# Altium schematic sheet HW_Mechanical_Parts.SchDoc: HW_Mechanical_Parts
size A4; Date: Not used; ApprovedBy: Not used; CheckedBy: Not used; Author: Not used; CompanyName: STMicroelectronics; DrawnBy: Not used; Engineer: Not used; Organization: Not used; Address1: Not used; Address2: Not used; Address3: Not used; Address4: Not used; DocumentNumber: Not used; Revision: Not used; SheetNumber: 22; SheetTotal: 22; CurrentTime: Not used; CurrentDate: Not used; Time: Not used; DocumentFullPathAndName: Not used; DocumentName: Not used; ModifiedDate: Not used; ImagePath: Not used; ProjectName: Not used; Application_BuildNumber: Not used
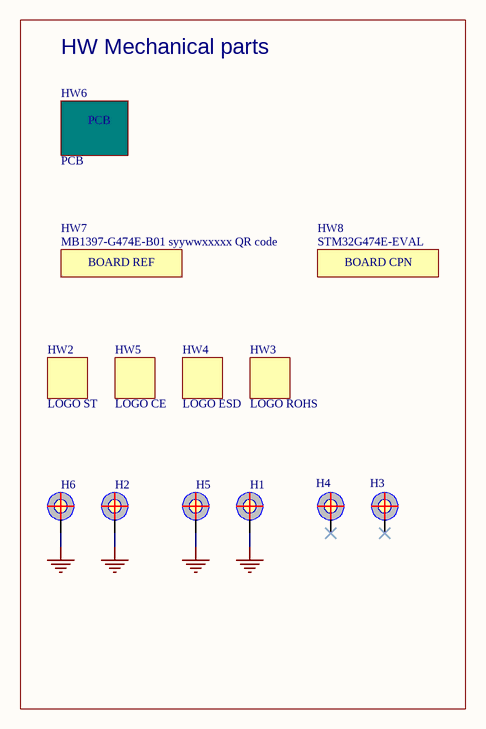
[diagram p0: HW_Mechanical_Parts.SchDoc]

## Parts
H1  POSITION HOLE C7D3R5  [PTH_350_700]  (value not drawn)  (no BOM)
H2  POSITION HOLE C7D3R5  [PTH_350_700]  (value not drawn)  (no BOM)
H3  POSITION HOLE C3R5D3R5  [NPTH_350]  (value not drawn)  (no BOM)
H4  POSITION HOLE C3R5D3R5  [NPTH_350]  (value not drawn)  (no BOM)
H5  POSITION HOLE C7D3R5  [PTH_350_700]  (value not drawn)  (no BOM)
H6  POSITION HOLE C7D3R5  [PTH_350_700]  (value not drawn)  (no BOM)
HW2  value LOGO ST  [LOGO_ST]  (hidden comment: Logo)  (no BOM)
HW3  value LOGO ROHS  [LOGO_ROHS]  (hidden comment: Logo)  (no BOM)
HW4  value LOGO ESD  [LOGO_MAIN_1]  (hidden comment: Logo)  (no BOM)
HW5  value LOGO CE  [LOGO_CE]  (hidden comment: Logo)  (no BOM)
HW6  PCB
HW7  value MB1397-G474E-B01 syywwxxxxx QR code  [STICKER_25X9]  (hidden comment: STICKER_BOARD_REF)  (mechanical)
HW8  value STM32G474E-EVAL  (hidden comment: STICKER_BOARD_CPN)  (mechanical)

## Blocks framed on the sheet
HW Mechanical parts: H1-H6 HW2-HW8

## Nets
GND: H1.1 H2.1 H5.1 H6.1

Not connected (* = marked no-connect by the designer): H3 1*; H4 1*

## Notes on the sheet
- Title:
- Project:
- Size:
- Revision:
- Variant:
- A4
- -
- Date:
- Reference:
- Sheet:
- of
- (in symbol MCD-00235) BOARD REF
- (in symbol MCD-00549) BOARD CPN

## Library data of the parts
H1 H2 H5 H6 = MCD-00328: Part_Type: Mechanical; Initial_Board_Reference: MB1311; Path: ws/MCD_ApplicationBoards/Lists/MCDPARTSdatabase; Item Type: Item; Internal_Part_Number: MCD-00328; Status: Released; Provided_By: n/a; ComponentLink1Description: Datasheet
H3 H4 = MCD-01368: Part_Type: Mechanical; Initial_Board_Reference: MB1397; Path: ws/MCD_ApplicationBoards/Lists/MCDPARTSdatabase; Item Type: Item; Internal_Part_Number: MCD-01368; Status: Checked; Provided_By: n/a; ComponentLink1Description: Datasheet; Value: POSITION HOLE C3R5D3R5; Manufacturer_Part_Number: n/a; Manufacturer: n/a
HW2 = MCD-00625: STMicroelectronics logo footprint for PCB; Part_Type: Mechanical; Initial_Board_Reference: MB1331; Path: ws/MCD_ApplicationBoards/Lists/MCDPARTSdatabase; Item Type: Item; Internal_Part_Number: MCD-00625; Status: Released; Provided_By: n/a; Manufacturer_Part_Number: n/a; Manufacturer: n/a; ComponentLink1Description: Datasheet; ComponentLink1URL: http://na
HW3 = MCD-00628: ROHS logo footprint for PCB; Part_Type: Mechanical; Initial_Board_Reference: MB1331; Path: ws/MCD_ApplicationBoards/Lists/MCDPARTSdatabase; Item Type: Item; Internal_Part_Number: MCD-00628; Status: Released; Provided_By: n/a; ComponentLink1Description: Datasheet
HW4 = MCD-00627: Hand ESD logo footprint for PCB; Part_Type: Mechanical; Initial_Board_Reference: MB1331; Path: ws/MCD_ApplicationBoards/Lists/MCDPARTSdatabase; Item Type: Item; Internal_Part_Number: MCD-00627; Status: Released; Provided_By: n/a; Manufacturer_Part_Number: n/a; Manufacturer: n/a; ComponentLink1Description: Datasheet; ComponentLink1URL: http://na
HW5 = MCD-00626: CE logo footprint for PCB; Part_Type: Mechanical; Initial_Board_Reference: MB1331; Path: ws/MCD_ApplicationBoards/Lists/MCDPARTSdatabase; Item Type: Item; Internal_Part_Number: MCD-00626; Status: Released; Provided_By: n/a; ComponentLink1Description: Datasheet
HW6 = PCB: Manuf_Part_1: MB1397 PCB; Manuf_1: Jiubaba; Ordered by: Subcon; Fitted: YES; Revision: 17-Jul-2002: Re-released for DXP Platform.; ECCN_US/EU: n/a
HW7 = MCD-00235: Sticker to mention board reference + serial number; Part_Type: Mechanical; Provided_By: SUBCO; Initial_Board_Reference: MB1319; Path: ws/MCD_ApplicationBoards/Lists/MCDPARTSdatabase; Item Type: Item; Internal_Part_Number: MCD-00235; Status: Released; Manufacturer_Part_Number: n/a; Manufacturer: n/a; ComponentLink1Description: Datasheet; ComponentLink1URL: n/a
HW8 = MCD-00549: Sticker to mention board CPN code; Part_Type: Mechanical; Provided_By: Subcon; Initial_Board_Reference: mb1319; Internal_Part_Number: MCD-00549; ECCN_US: n/a; ECCN_EU: n/a; Status: Released